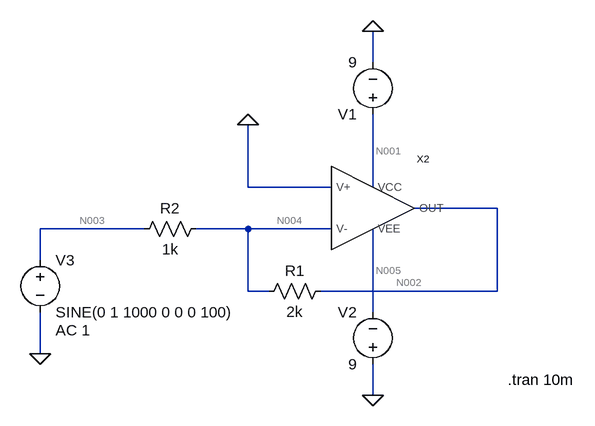
[diagram p0: schematic Test.asc]
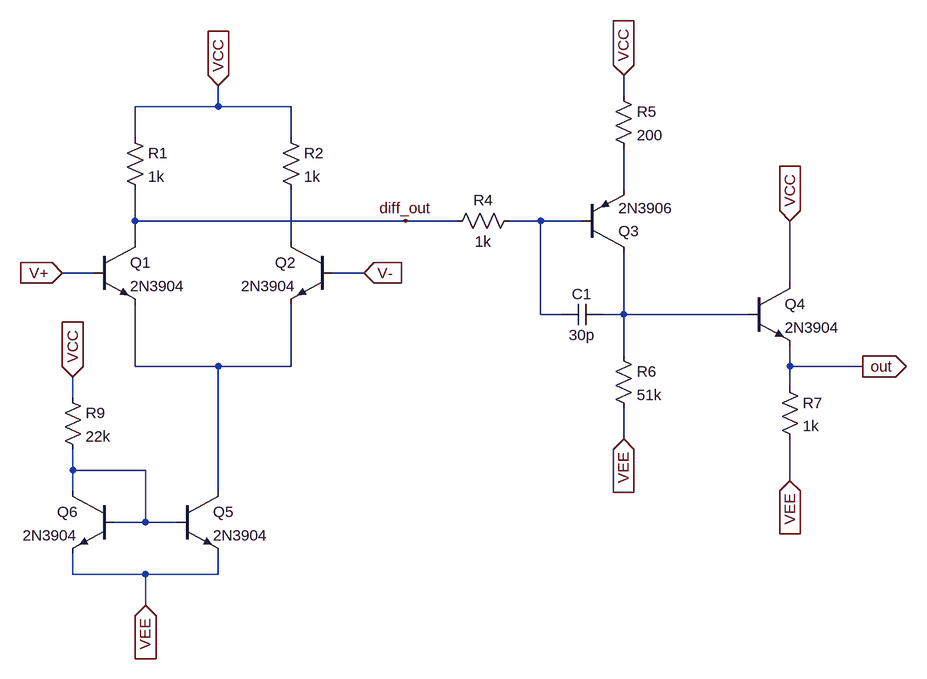
[diagram p1: sub-circuit giug_amp_101.asc]
Test.asc, the LTspice schematic file:
Version 4
SHEET 1 880 680
WIRE 256 -48 256 -96
WIRE 64 144 64 48
WIRE 192 144 64 144
WIRE 256 144 256 32
WIRE 448 176 320 176
WIRE -96 208 -256 208
WIRE 64 208 -16 208
WIRE 192 208 64 208
WIRE -256 256 -256 208
WIRE 64 304 64 208
WIRE 96 304 64 304
WIRE 448 304 448 176
WIRE 448 304 176 304
WIRE 256 336 256 208
WIRE -256 400 -256 336
WIRE 256 464 256 416
FLAG 256 464 0
FLAG 256 -96 0
FLAG 64 48 0
FLAG -256 400 0
SYMBOL voltage 256 48 R180
WINDOW 123 0 0 Left 0
WINDOW 39 0 0 Left 0
SYMATTR InstName V1
SYMATTR Value 9
SYMBOL voltage 256 432 R180
WINDOW 0 24 96 Left 2
WINDOW 3 24 16 Left 2
WINDOW 123 0 0 Left 0
WINDOW 39 0 0 Left 0
SYMATTR InstName V2
SYMATTR Value 9
SYMBOL res 192 288 R90
WINDOW 0 0 56 VBottom 2
WINDOW 3 32 56 VTop 2
SYMATTR InstName R1
SYMATTR Value 2k
SYMBOL res 0 192 R90
WINDOW 0 0 56 VBottom 2
WINDOW 3 32 56 VTop 2
SYMATTR InstName R2
SYMATTR Value 1k
SYMBOL voltage -256 240 R0
WINDOW 123 24 124 Left 2
WINDOW 39 0 0 Left 0
SYMATTR Value2 AC 1
SYMATTR InstName V3
SYMATTR Value SINE(0 1 1000 0 0 0 100)
SYMBOL Giug_Amp_101 256 176 R0
SYMATTR InstName X2
TEXT 464 440 Left 2 !.tran 10m

giug_amp_101.asc, the sub-circuit schematic file:
Version 4
SHEET 1 1536 712
WIRE 1072 -176 1072 -208
WIRE 448 -160 448 -192
WIRE 448 -160 320 -160
WIRE 560 -160 448 -160
WIRE 320 -112 320 -160
WIRE 560 -112 560 -160
WIRE 1072 -32 1072 -96
WIRE 320 16 320 -32
WIRE 736 16 320 16
WIRE 816 16 736 16
WIRE 944 16 896 16
WIRE 1008 16 944 16
WIRE 320 48 320 16
WIRE 560 48 560 -32
WIRE 256 96 208 96
WIRE 672 96 624 96
WIRE 1328 112 1328 16
WIRE 944 160 944 16
WIRE 976 160 944 160
WIRE 1072 160 1072 64
WIRE 1072 160 1040 160
WIRE 1264 160 1072 160
WIRE 1072 224 1072 160
WIRE 320 240 320 144
WIRE 448 240 320 240
WIRE 560 240 560 144
WIRE 560 240 448 240
WIRE 1328 240 1328 208
WIRE 1440 240 1328 240
WIRE 1328 272 1328 240
WIRE 224 288 224 256
WIRE 1072 352 1072 304
WIRE 224 400 224 368
WIRE 336 400 224 400
WIRE 1328 416 1328 352
WIRE 224 432 224 400
WIRE 448 432 448 240
WIRE 336 480 336 400
WIRE 336 480 288 480
WIRE 384 480 336 480
WIRE 224 560 224 528
WIRE 336 560 224 560
WIRE 448 560 448 528
WIRE 448 560 336 560
WIRE 336 608 336 560
FLAG 448 -192 VCC
IOPIN 448 -192 In
FLAG 736 16 diff_out
FLAG 1072 -208 VCC
IOPIN 1072 -208 In
FLAG 1328 16 VCC
IOPIN 1328 16 In
FLAG 1440 240 out
IOPIN 1440 240 Out
FLAG 1072 352 VEE
IOPIN 1072 352 In
FLAG 1328 416 VEE
IOPIN 1328 416 In
FLAG 336 608 VEE
IOPIN 336 608 In
FLAG 224 256 VCC
IOPIN 224 256 In
FLAG 672 96 V-
IOPIN 672 96 In
FLAG 208 96 V+
IOPIN 208 96 In
SYMBOL res 304 -128 R0
SYMATTR InstName R1
SYMATTR Value 1k
SYMBOL res 544 -128 R0
SYMATTR InstName R2
SYMATTR Value 1k
SYMBOL npn 256 48 R0
SYMATTR InstName Q1
SYMATTR Value 2N3904
SYMBOL npn 624 48 M0
SYMATTR InstName Q2
SYMATTR Value 2N3904
SYMBOL res 912 0 R90
WINDOW 0 0 56 VBottom 2
WINDOW 3 32 56 VTop 2
SYMATTR InstName R4
SYMATTR Value 1k
SYMBOL pnp 1008 64 M180
SYMATTR InstName Q3
SYMATTR Value 2N3906
SYMBOL res 1056 -192 R0
SYMATTR InstName R5
SYMATTR Value 200
SYMBOL cap 1040 144 R90
WINDOW 0 0 32 VBottom 2
WINDOW 3 32 32 VTop 2
SYMATTR InstName C1
SYMATTR Value 30p
SYMBOL res 1056 208 R0
SYMATTR InstName R6
SYMATTR Value 51k
SYMBOL npn 1264 112 R0
SYMATTR InstName Q4
SYMATTR Value 2N3904
SYMBOL res 1312 256 R0
SYMATTR InstName R7
SYMATTR Value 1k
SYMBOL npn 384 432 R0
SYMATTR InstName Q5
SYMATTR Value 2N3904
SYMBOL npn 288 432 M0
SYMATTR InstName Q6
SYMATTR Value 2N3904
SYMBOL res 208 272 R0
SYMATTR InstName R9
SYMATTR Value 22k

The netlist it stands for:
* Test.asc
V1 N001 0 9
V2 0 N005 9
R1 N002 N004 2k
R2 N004 N003 1k
V3 N003 0 SINE(0 1 1000 0 0 0 100) AC 1
XX2 0 N004 N002 N001 N005 giug_amp_101

* block symbol definitions
.subckt giug_amp_101 V+ V- OUT VCC VEE
R1 VCC diff_out 1k
R2 VCC N003 1k
Q1 diff_out V+ N005 0 2N3904
Q2 N003 V- N005 0 2N3904
R4 N002 diff_out 1k
Q3 N004 N002 N001 0 2N3906
R5 VCC N001 200
C1 N004 N002 30p
R6 N004 VEE 51k
Q4 VCC N004 out 0 2N3904
R7 out VEE 1k
Q5 N005 N006 VEE 0 2N3904
Q6 N006 N006 VEE 0 2N3904
R9 VCC N006 22k
.ends giug_amp_101

.model NPN NPN
.model PNP PNP
.lib standard.bjt
.tran 10m
.backanno
.end

* Results of the author's LTspice run, read from the files saved beside the schematic
* Operating Point, zero values left out:
*   V(n001) = 9 V
*   V(n005) = -9 V
*   V(n002) = -99.43 mV
*   V(n004) = -33.52 mV
*   I(R1) = -32.96 µA
*   I(R2) = -33.52 µA
*   I(V1) = -10.69 mA
*   I(V2) = -10.72 mA
*   I(V3) = -33.52 µA
*   Ix(x2:V+) = 2.031 µA
*   Ix(x2:V-) = 557.5 nA
*   Ix(x2:OUT) = 32.96 µA
*   Ix(x2:VCC) = 10.69 mA
*   Ix(x2:VEE) = -10.72 mA
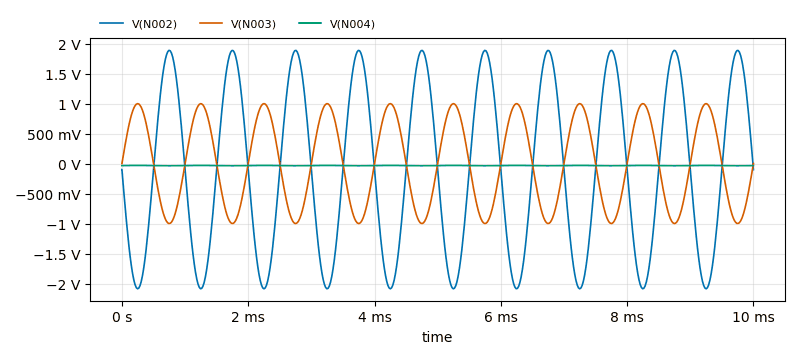
[diagram p2: Transient Analysis of Test.asc, plotted from the saved traces]
* Transient Analysis, 1 run:
*   V(N002): min -2.088 V, max 1.888 V, average -99.41 mV, rms 1.41 V, last -98.9 mV
*   V(N003): min -999.5 mV, max 1 V, average -5.329 µV, rms 707.1 mV, last 0 V
*   V(N004): min -36.59 mV, max -30.43 mV, average -33.51 mV, rms 33.58 mV, last -33.34 mV